# EasyEDA schematic EasyEDA_Source.json
TITLE: F7v2 Core-Compute Dev Module w/Dual Ether.; REV: v2.a; Date: 2023.01; Sheet: 1/1; Drawn By: bryan costanich; Company: Wilderness Labs
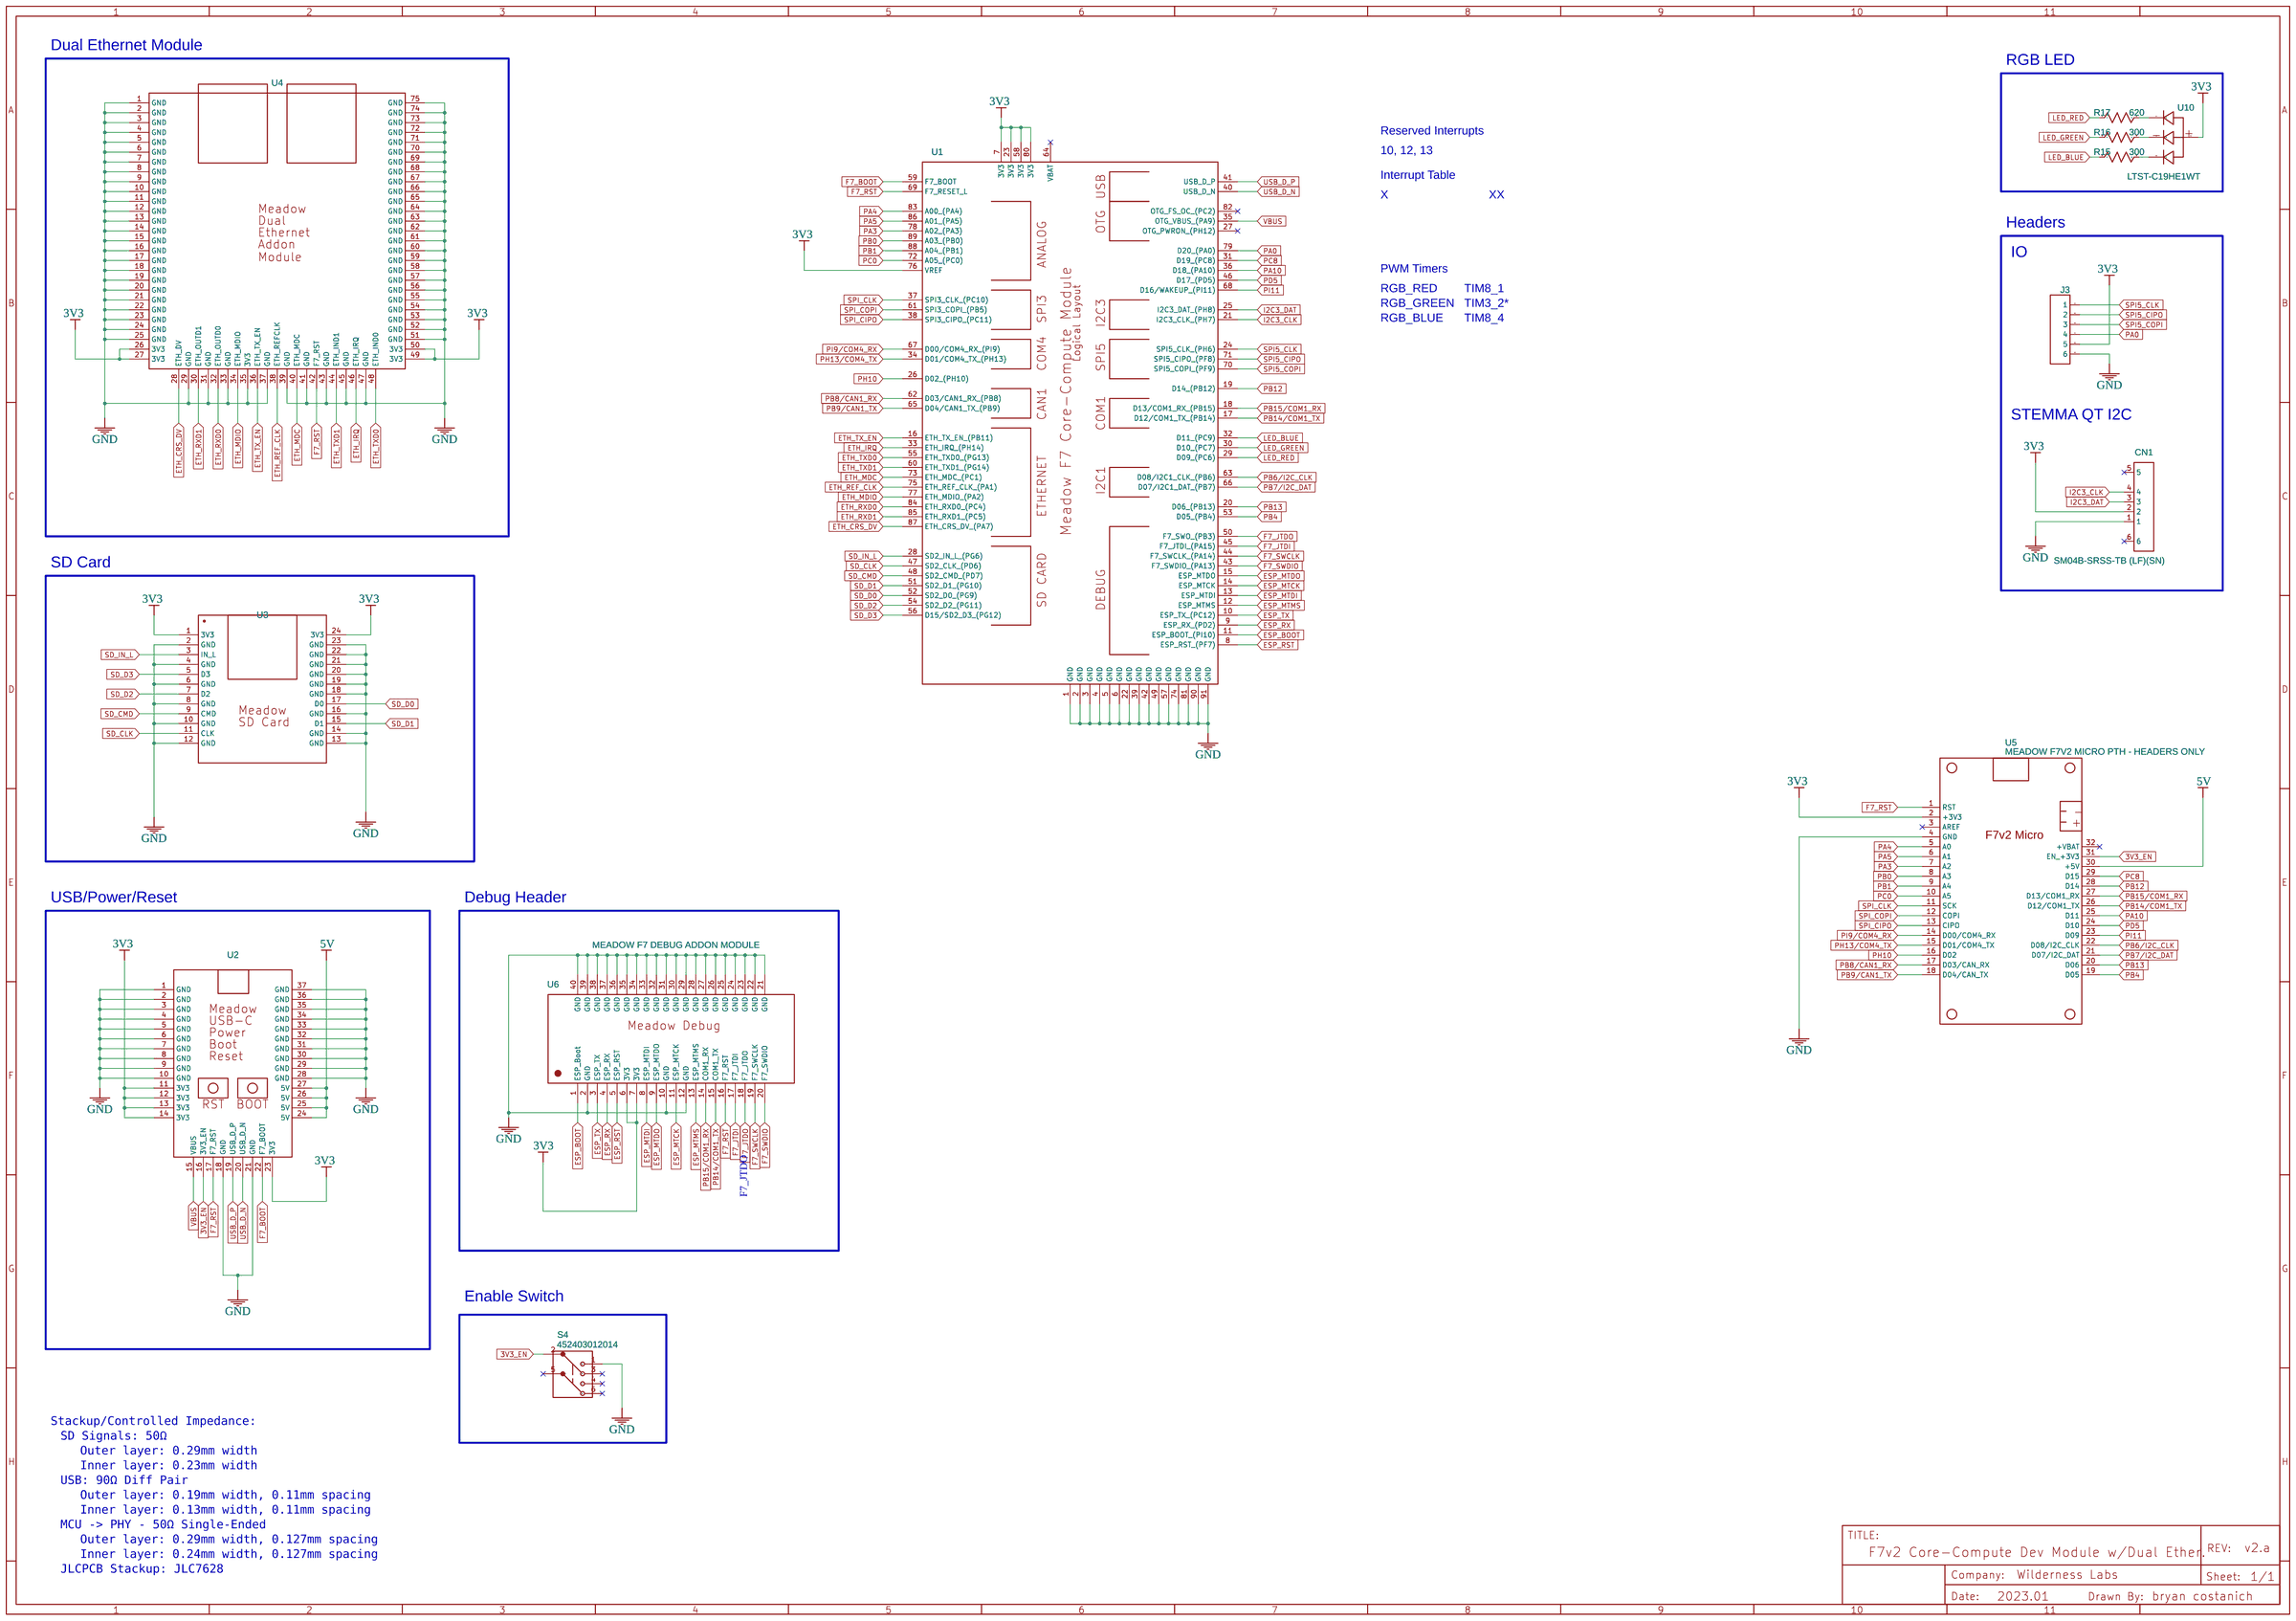
[diagram p0: schematic sheet]

## Parts
CN1  SM04B-SRSS-TB (LF)(SN)  [CONN-SMD_4P-P1.00_SM04B-SRSS-TB-LF-SN]
J3  HDR-M-2.54_1x6  [HDR-M-2.54_1X6]
R15  300  [R0603]
R16  300  [R0603]
R17  620  [R0603]
S4  452403012014  [452403012014]
U1  Meadow F7v2 Core-Compute Module - Logical  [MEADOW_F7V2_CORE_COMPUTE]
U2  Meadow Core-Compute USB-C, Power, Boot, and Reset Addon Module  [MEADOW CORE-COMPUTE USB-C, POWER, BOOT, RESET ADDON MODULE]
U3  Meadow Core-Compute SD-Card Addon  [MEADOW CORE-COMPUTE SD CARD ADD MODULE]
U4  MEADOW CORE-COMPUTE DUAL ETHERNET ADDON MODULE  [MEADOW CORE-COMPUTE DUAL ETHERNET ADDON MODULE]
U5  MEADOW F7V2 MICRO PTH - HEADERS ONLY  [MEADOWF7MICROV2_PTH_HEADERS_ONLY]
U6  MEADOW F7 DEBUG ADDON MODULE  [MEADOW F7 DEBUG ADDON MODULE]
U10  LTST-C19HE1WT  [LED-ARRAY-SMD_0603-4P-L1.6-W1.6-BL-RD]

## Library data of the parts
CN1 = SM04B-SRSS-TB (LF)(SN): Supplier: LCSC; Supplier Part: C160404; Manufacturer: JST Sales America; Contributor: LCSC; JLCPCB Part Class: Extended Part
J3 = HDR-M-2.54_1x6: Supplier Part: C190819; Supplier: LCSC; Contributor: LCEDA_Lib
R15 R16 = R_0603_US: Contributor: LCEDA_Lib; Manufacturer Part: RC0603FR-07300RL; Manufacturer: Yageo
R17 = R_0603_US: Contributor: LCEDA_Lib; Manufacturer Part: RC0603FR-07620RL; Manufacturer: Yageo
S4 = 452403012014: WS-SLSV; Contributor: fsadrzad; Manufacturer: Wurth Elektronik
U1 = Meadow F7v2 Core-Compute Module - Logical: Manufacturer: Wilderness Labs; link: https://www.wildernesslabs.co/hardware; Contributor: bryan_6020
U2 = Meadow Core-Compute USB-C, Power, Boot, and Reset Addon Module: Manufacturer: Wilderness Labs; Contributor: bryan_6020
U3 = Meadow Core-Compute SD-Card Addon: Manufacturer: Wilderness Labs; Contributor: bryan_6020
U4 = MEADOW CORE-COMPUTE DUAL ETHERNET ADDON MODULE: Manufacturer: Wilderness Labs; Contributor: bryan_6020
U5 = MEADOW F7V2 MICRO PTH - HEADERS ONLY: Manufacturer: Wilderness Labs; Manufacturer Part: MEDF7DEV; Supplier: Mouser; Supplier Part: 977-MEADOWF7MICRO; link: https://store.wildernesslabs.co/collections/frontpage/products/meadow-f7; Contributor: bryan costanich
U6 = MEADOW F7 DEBUG ADDON MODULE: Contributor: bryan_6020
U10 = LTST-C19HE1WT-H: Supplier: LCSC; Supplier Part: C427425; Manufacturer: Lite-On; Contributor: LCSC; JLCPCB Part Class: Extended Part

## Nets
3V3: CN1.2 J3.5 U1.7(3V3) U1.23(3V3) U1.58(3V3) U1.76(VREF) U1.80(3V3) U2.11(3V3) U2.12(3V3) U2.13(3V3) U2.14(3V3) U2.23(3V3) U3.1(3V3) U3.24(3V3) U4.26(3V3) U4.27(3V3) U4.49(3V3) U4.50(3V3) U5.2(+3V3) U6.6(3V3) U6.7(3V3) U10.4(A)
3V3_EN: S4.2(1) U2.16(3V3_EN) U5.31(EN_+3V3)
5V: U2.24(5V) U2.25(5V) U2.26(5V) U2.27(5V) U5.30(+5V)
GND: CN1.1 J3.6 S4.1 U1.1(GND) U1.2(GND) U1.3(GND) U1.4(GND) U1.5(GND) U1.6(GND) U1.22(GND) U1.39(GND) U1.42(GND) U1.49(GND) U1.57(GND) U1.74(GND) U1.81(GND) U1.90(GND) U1.91(GND) U2.1(GND) U2.2(GND) U2.3(GND) U2.4(GND) U2.5(GND) U2.6(GND) U2.7(GND) U2.8(GND) U2.9(GND) U2.10(GND) U2.18(GND) U2.21(GND) U2.28(GND) U2.29(GND) U2.30(GND) U2.31(GND) U2.32(GND) U2.33(GND) U2.34(GND) U2.35(GND) U2.36(GND) U2.37(GND) U3.2(GND) U3.4(GND) U3.6(GND) U3.8(GND) U3.10(GND) U3.12(GND) U3.13(GND) U3.14(GND) U3.16(GND) U3.18(GND) U3.19(GND) U3.20(GND) U3.21(GND) U3.22(GND) U3.23(GND) U4.1(GND) U4.2(GND) U4.3(GND) U4.4(GND) U4.5(GND) U4.6(GND) U4.7(GND) U4.8(GND) U4.9(GND) U4.10(GND) U4.11(GND) U4.12(GND) U4.13(GND) U4.14(GND) U4.15(GND) U4.16(GND) U4.17(GND) U4.18(GND) U4.19(GND) U4.20(GND) U4.21(GND) U4.22(GND) U4.23(GND) U4.24(GND) U4.25(GND) U4.29(GND) U4.31(GND) U4.33(GND) U4.35(3V3) U4.37(GND) U4.39(GND) U4.41(GND) U4.43(GND) U4.45(GND) U4.47(GND) U4.51(GND) U4.52(GND) U4.53(GND) U4.54(GND) U4.55(GND) U4.56(GND) U4.57(GND) U4.58(GND) U4.59(GND) U4.60(GND) U4.61(GND) U4.62(GND) U4.63(GND) U4.64(GND) U4.65(GND) U4.66(GND) U4.67(GND) U4.68(GND) U4.69(GND) U4.70(GND) U4.71(GND) U4.72(GND) U4.73(GND) U4.74(GND) U4.75(GND) U5.4(GND) U6.2(GND) U6.10(GND) U6.12(GND) U6.21(GND) U6.22(GND) U6.23(GND) U6.24(GND) U6.25(GND) U6.26(GND) U6.27(GND) U6.28(GND) U6.29(GND) U6.30(GND) U6.31(GND) U6.32(GND) U6.33(GND) U6.34(GND) U6.35(GND) U6.36(GND) U6.37(GND) U6.38(GND) U6.39(GND) U6.40(GND)
VBUS: U1.35(OTG_VBUS (PA9)) U2.15(VBUS)
ESP_BOOT: U1.11(ESP_BOOT (PI10)) U6.1(ESP_Boot)
ESP_MTCK: U1.14(ESP_MTCK) U6.11(ESP_MTCK)
ESP_MTDI: U1.13(ESP_MTDI) U6.8(ESP_MTDI)
ESP_MTDO: U1.15(ESP_MTDO) U6.9(ESP_MTDO)
ESP_MTMS: U1.12(ESP_MTMS) U6.13(ESP_MTMS)
ESP_RST: U1.8(ESP_RST (PF7)) U6.5(ESP_RST)
ESP_RX: U1.9(ESP_RX (PD2)) U6.4(ESP_RX)
ESP_TX: U1.10(ESP_TX (PC12)) U6.3(ESP_TX)
ETH_CRS_DV: U1.87(ETH_CRS_DV (PA7)) U4.28(ETH_DV)
ETH_IRQ: U1.33(ETH_IRQ (PH14)) U4.46(ETH_IRQ)
ETH_MDC: U1.73(ETH_MDC (PC1)) U4.40(ETH_MDC)
ETH_MDIO: U1.77(ETH_MDIO (PA2)) U4.34(ETH_MDIO)
ETH_REF_CLK: U1.75(ETH_REF_CLK (PA1)) U4.38(ETH_REFCLK)
ETH_RXD0: U1.84(ETH_RXD0 (PC4)) U4.32(ETH_OUTD0)
ETH_RXD1: U1.85(ETH_RXD1 (PC5)) U4.30(ETH_OUTD1)
ETH_TX_EN: U1.16(ETH_TX_EN (PB11)) U4.36(ETH_TX_EN)
ETH_TXD0: U1.55(ETH_TXD0 (PG13)) U4.48(ETH_IND0)
ETH_TXD1: U1.60(ETH_TXD1 (PG14)) U4.44(ETH_IND1)
F7_BOOT: U1.59(F7_BOOT) U2.22(F7_BOOT)
F7_JTDI: U1.45(F7_JTDI (PA15)) U6.17(F7_JTDI)
F7_JTDO: U1.50(F7_SWO (PB3)) U6.18(F7_JTDO)
F7_RST: U1.69(F7_RESET_L) U2.17(F7_RST) U4.42(F7_RST) U5.1(RST) U6.16(F7_RST)
F7_SWCLK: U1.44(F7_SWCLK (PA14)) U6.19(F7_SWCLK)
F7_SWDIO: U1.43(F7_SWDIO (PA13)) U6.20(F7_SWDIO)
I2C3_CLK: CN1.4 U1.21(I2C3_CLK (PH7))
I2C3_DAT: CN1.3 U1.25(I2C3_DAT (PH8))
LED_BLUE: R15.1 U1.32(D11 (PC9))
LED_GREEN: R16.1 U1.30(D10 (PC7))
LED_RED: R17.1 U1.29(D09 (PC6))
PA0: J3.4 U1.79(D20 (PA0))
PA3: U1.78(A02 (PA3)) U5.7(A2)
PA4: U1.83(A00 (PA4)) U5.5(A0)
PA5: U1.86(A01 (PA5)) U5.6(A1)
PA10: U1.36(D18 (PA10)) U5.25(D11)
PB0: U1.89(A03 (PB0)) U5.8(A3)
PB1: U1.88(A04 (PB1)) U5.9(A4)
PB4: U1.53(D05 (PB4)) U5.19(D05)
PB6/I2C_CLK: U1.63(D08/I2C1_CLK (PB6)) U5.22(D08/I2C_CLK)
PB7/I2C_DAT: U1.66(D07/I2C1_DAT (PB7)) U5.21(D07/I2C_DAT)
PB8/CAN1_RX: U1.62(D03/CAN1_RX (PB8)) U5.17(D03/CAN_RX)
PB9/CAN1_TX: U1.65(D04/CAN1_TX (PB9)) U5.18(D04/CAN_TX)
PB12: U1.19(D14 (PB12)) U5.28(D14)
PB13: U1.20(D06 (PB13)) U5.20(D06)
PB14/COM1_TX: U1.17(D12/COM1_TX (PB14)) U5.26(D12/COM1_TX) U6.15(COM1_TX)
PB15/COM1_RX: U1.18(D13/COM1_RX (PB15)) U5.27(D13/COM1_RX) U6.14(COM1_RX)
PC0: U1.72(A05 (PC0)) U5.10(A5)
PC8: U1.31(D19 (PC8)) U5.29(D15)
PD5: U1.46(D17 (PD5)) U5.24(D10)
PH10: U1.26(D02 (PH10)) U5.16(D02)
PH13/COM4_TX: U1.34(D01/COM4_TX (PH13)) U5.15(D01/COM4_TX)
PI9/COM4_RX: U1.67(D00/COM4_RX (PI9)) U5.14(D00/COM4_RX)
PI11: U1.68(D16/WAKEUP (PI11)) U5.23(D09)
SD_CLK: U1.47(SD2_CLK (PD6)) U3.11(CLK)
SD_CMD: U1.48(SD2_CMD (PD7)) U3.9(CMD)
SD_D0: U1.52(SD2_D0 (PG9)) U3.17(D0)
SD_D1: U1.51(SD2_D1 (PG10)) U3.15(D1)
SD_D2: U1.54(SD2_D2 (PG11)) U3.7(D2)
SD_D3: U1.56(D15/SD2_D3 (PG12)) U3.5(D3)
SD_IN_L: U1.28(SD2_IN_L (PG6)) U3.3(IN_L)
SPI5_CIPO: J3.2 U1.71(SPI5_CIPO (PF8))
SPI5_CLK: J3.1 U1.24(SPI5_CLK (PH6))
SPI5_COPI: J3.3 U1.70(SPI5_COPI (PF9))
SPI_CIPO: U1.38(SPI3_CIPO (PC11)) U5.13(CIPO)
SPI_CLK: U1.37(SPI3_CLK (PC10)) U5.11(SCK)
SPI_COPI: U1.61(SPI3_COPI (PB5)) U5.12(COPI)
USB_D_N: U1.40(USB_D_N) U2.20(USB_D_N)
USB_D_P: U1.41(USB_D_P) U2.19(USB_D_P)
Net-(R15-2): R15.2 U10.3(C3)
Net-(R16-2): R16.2 U10.2(C2)
Net-(R17-2): R17.2 U10.1(C1)

Not connected (* = marked no-connect by the designer): CN1 5* 6*; S4 3(1)* 4(1)* 5(2)* 6(1)*; U1 27(OTG_PWRON (PH12))* 64(VBAT)* 82(OTG_FS_OC (PC2))*; U5 3(AREF)* 32(+VBAT)*

## Notes on the sheet
- Dual Ethernet Module
- RGB LED
- Reserved Interrupts
- 10, 12, 13
- Interrupt Table
- X
- XX
- Headers
- IO
- PWM Timers
- RGB_RED
- TIM8_1
- RGB_GREEN
- TIM3_2*
- RGB_BLUE
- TIM8_4
- STEMMA QT I2C
- SD Card
- USB/Power/Reset
- Debug Header
- F7_JTDO
- Enable Switch
- Stackup/Controlled Impedance:
- SD Signals: 50Ω
- Outer layer: 0.29mm width
- Inner layer: 0.23mm width
- USB: 90Ω Diff Pair
- Outer layer: 0.19mm width, 0.11mm spacing
- Inner layer: 0.13mm width, 0.11mm spacing
- MCU -> PHY - 50Ω Single-Ended
- Outer layer: 0.29mm width, 0.127mm spacing
- Inner layer: 0.24mm width, 0.127mm spacing
- JLCPCB Stackup: JLC7628
